# Altium schematic sheet motor.SchDoc
size A4; SheetNumber: 5
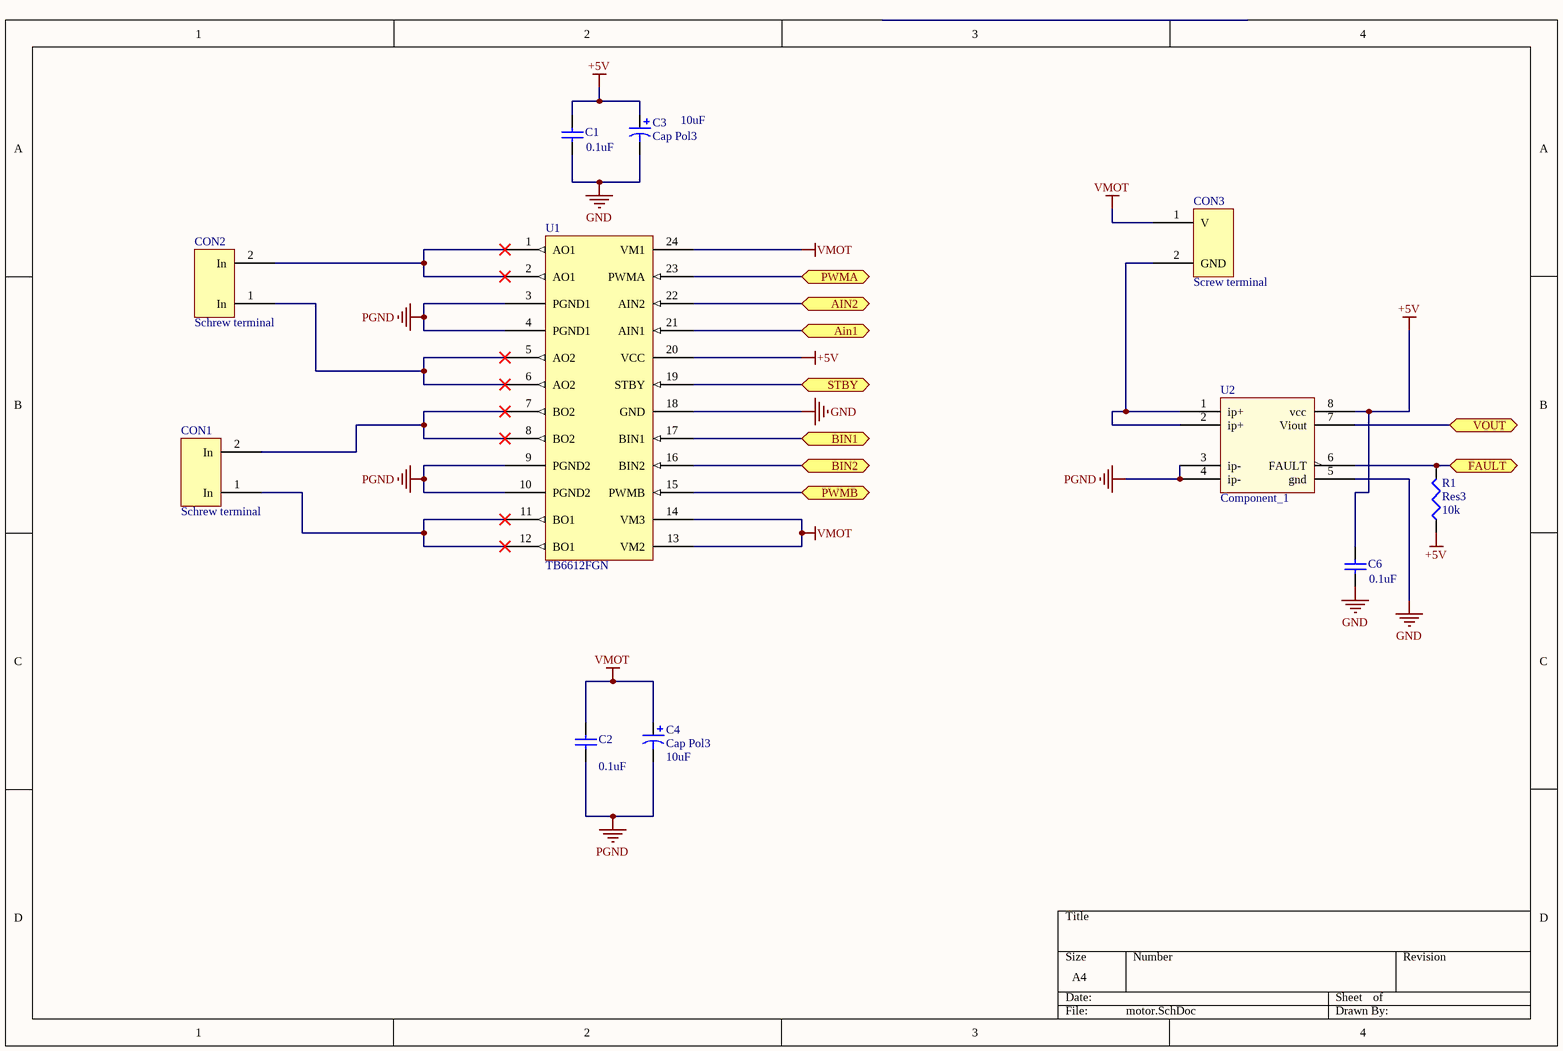
[diagram p0: motor.SchDoc]

## Parts
C1  value 0.1uF  [1608[0603]]  (hidden comment: Cap Semi)
C2  value 0.1uF  [C1206]  (hidden comment: Cap Semi)
C3  Cap Pol3  value 10uF  [C0805]
C4  Cap Pol3  value 10uF  [C0805]
C6  value 0.1uF  [1608[0603]]  (hidden comment: Cap Semi)
CON1  Schrew terminal  [ScrewTerminal]
CON2  Schrew terminal  [ScrewTerminal]
CON3  Screw terminal  [ScrewTerminal]
R1  Res3  value 10k  [J1-0603]
U1  TB6612FGN  [TBS6612FNG]
U2  Component_1  [ACS711]

## Ports
Ain1, AIN2, BIN1, BIN2, FAULT, PWMA, PWMB, STBY, VOUT

## Nets
+5V: C1.1 C3.1 C6.1 R1.1 U1.20(VCC) U2.8(vcc)
GND: C1.2 C3.2 C6.2 U1.18(GND) U2.5(gnd)
PGND: C2.2 C4.2 U1.3(PGND1) U1.4(PGND1) U1.9(PGND2) U1.10(PGND2) U2.3(ip-) U2.4(ip-)
VMOT: C2.1 C4.1 CON3.1(V) U1.13(VM2) U1.14(VM3) U1.24(VM1)
Ain1: U1.21(AIN1) ; port Ain1
AIN2: U1.22(AIN2) ; port AIN2
BIN1: U1.17(BIN1) ; port BIN1
BIN2: U1.16(BIN2) ; port BIN2
FAULT: R1.2 U2.6(FAULT) ; port FAULT
PWMA: U1.23(PWMA) ; port PWMA
PWMB: U1.15(PWMB) ; port PWMB
STBY: U1.19(STBY) ; port STBY
VOUT: U2.7(Viout) ; port VOUT
NetCON1_1: CON1.1(In) U1.11(BO1) U1.12(BO1)
NetCON1_2: CON1.2(In) U1.7(BO2) U1.8(BO2)
NetCON2_1: CON2.1(In) U1.5(AO2) U1.6(AO2)
NetCON2_2: CON2.2(In) U1.1(AO1) U1.2(AO1)
NetCON3_2: CON3.2(GND) U2.1(ip+) U2.2(ip+)

## Library data of the parts
C1 C2 C6 = Cap Semi: Capacitor (Semiconductor SIM Model); Published: 8-Jun-2000; LatestRevisionDate: 29-May-2009; LatestRevisionNote: IPC-7351 Footprint Added.; PackageReference: C1206; Publisher: Altium Limited; PackageDescription: Chip Capacitor
C3 C4 = Cap Pol3: Polarized Capacitor (Surface Mount); Published: 8-Jun-2000; LatestRevisionDate: 29-May-2009; LatestRevisionNote: IPC-7351 Footprint Added.; PackageReference: C0805; Publisher: Altium Limited; PackageDescription: Chip Capacitor
CON3 = Schrew terminal
R1 = Res3: Resistor; Published: 8-Jun-2000; LatestRevisionDate: 29-May-2009; LatestRevisionNote: IPC-7351 Footprint Added.; PackageReference: J1-0603; Publisher: Altium Limited; PackageDescription: Chip Resistor